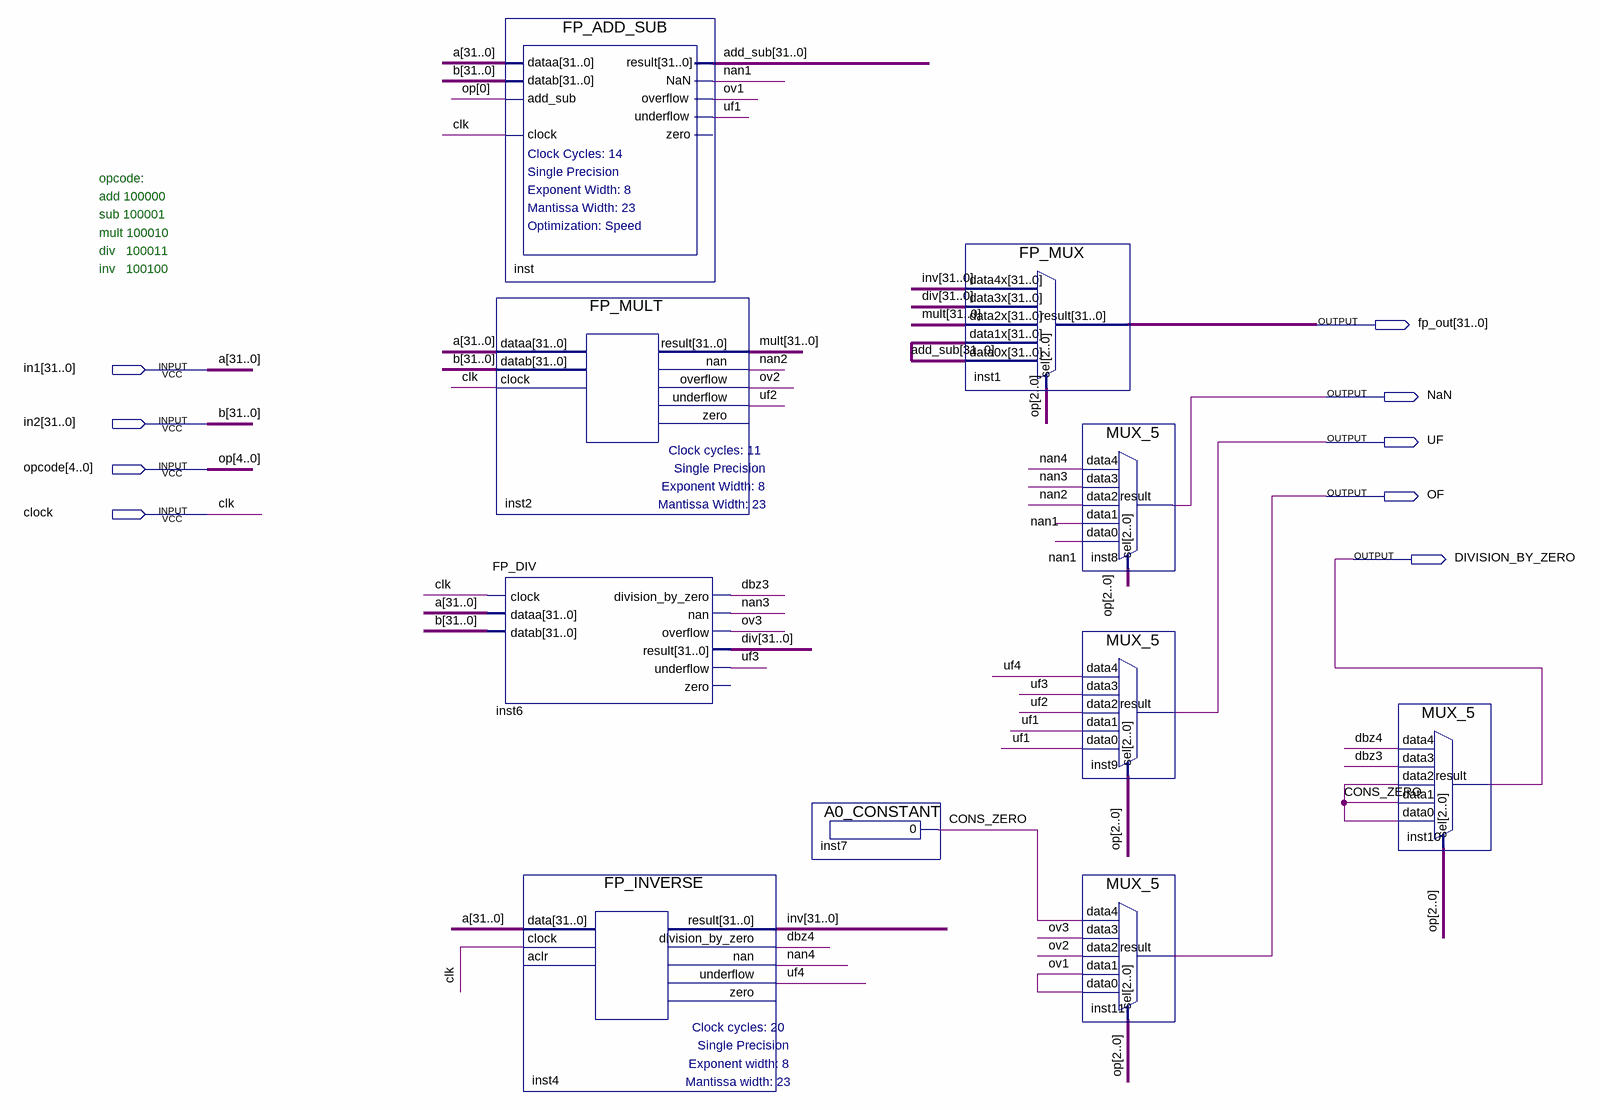
[diagram p0: schematic sheet]
// Quartus schematic FP_COPROCESSOR.bdf as structural Verilog: 10 symbols, 9 pins
module FP_COPROCESSOR (
  input  [31:0] in1,
  input  [31:0] in2,
  input  [4:0] opcode,
  input  clock,
  output [31:0] fp_out,
  output NaN,
  output UF,
  output OF,
  output DIVISION_BY_ZERO
);

  wire CONS_ZERO, dbz3, dbz4, nan1, nan2, nan3, nan4, ov1, ov2, ov3, uf1, uf2, uf3, uf4;
  wire [31:0] add_sub, div, inv, mult;

  FP_ADD_SUB inst (
    .dataa(in1), .datab(in2), .add_sub(opcode[0]), .clock(clock), .result(add_sub), .NaN(nan1),
    .overflow(ov1), .underflow(uf1));  // open: zero
  FP_MULT inst2 (
    .dataa(in1), .datab(in2), .clock(clock), .result(mult), .nan(nan2), .overflow(ov2), .underflow(uf2));  // open: zero
  FP_DIV inst6 (
    .clock(clock), .dataa(in1), .datab(in2), .division_by_zero(dbz3), .nan(nan3), .overflow(ov3),
    .result(div), .underflow(uf3));  // open: zero
  FP_INVERSE inst4 (
    .data(in1), .clock(clock), .result(inv), .division_by_zero(dbz4), .nan(nan4), .underflow(uf4));  // open: aclr, zero
  A0_CONSTANT inst7 (.result(CONS_ZERO));
  FP_MUX inst1 (
    .data4x(inv), .data3x(div), .data2x(mult), .data1x(add_sub), .data0x(add_sub), .sel(opcode[2:0]),
    .result(fp_out));
  MUX_5 inst8 (.data4(nan4), .data3(nan3), .data2(nan2), .data1(nan1), .data0(nan1), .sel(opcode[2:0]), .result(NaN));
  MUX_5 inst9 (.data4(uf4), .data3(uf3), .data2(uf2), .data1(uf1), .data0(uf1), .sel(opcode[2:0]), .result(UF));
  MUX_5 inst11 (.data4(CONS_ZERO), .data3(ov3), .data2(ov2), .data1(ov1), .data0(ov1), .sel(opcode[2:0]), .result(OF));
  MUX_5 inst10 (
    .data4(dbz4), .data3(dbz3), .data2(CONS_ZERO), .data1(CONS_ZERO), .data0(CONS_ZERO), .sel(opcode[2:0]),
    .result(DIVISION_BY_ZERO));

  // Other names for the same wires on the sheet: a[31:0] = in1; b[31:0] = in2; clk = clock; op[4:0] = opcode

  // Notes on the sheet:
  //   opcode:
  //   add 100000
  //   sub 100001
  //   mult 100010
  //   div   100011
  //   inv   100100
endmodule
